# EAGLE design Adafruit_LSM303DLHC (EAGLE 6.3)
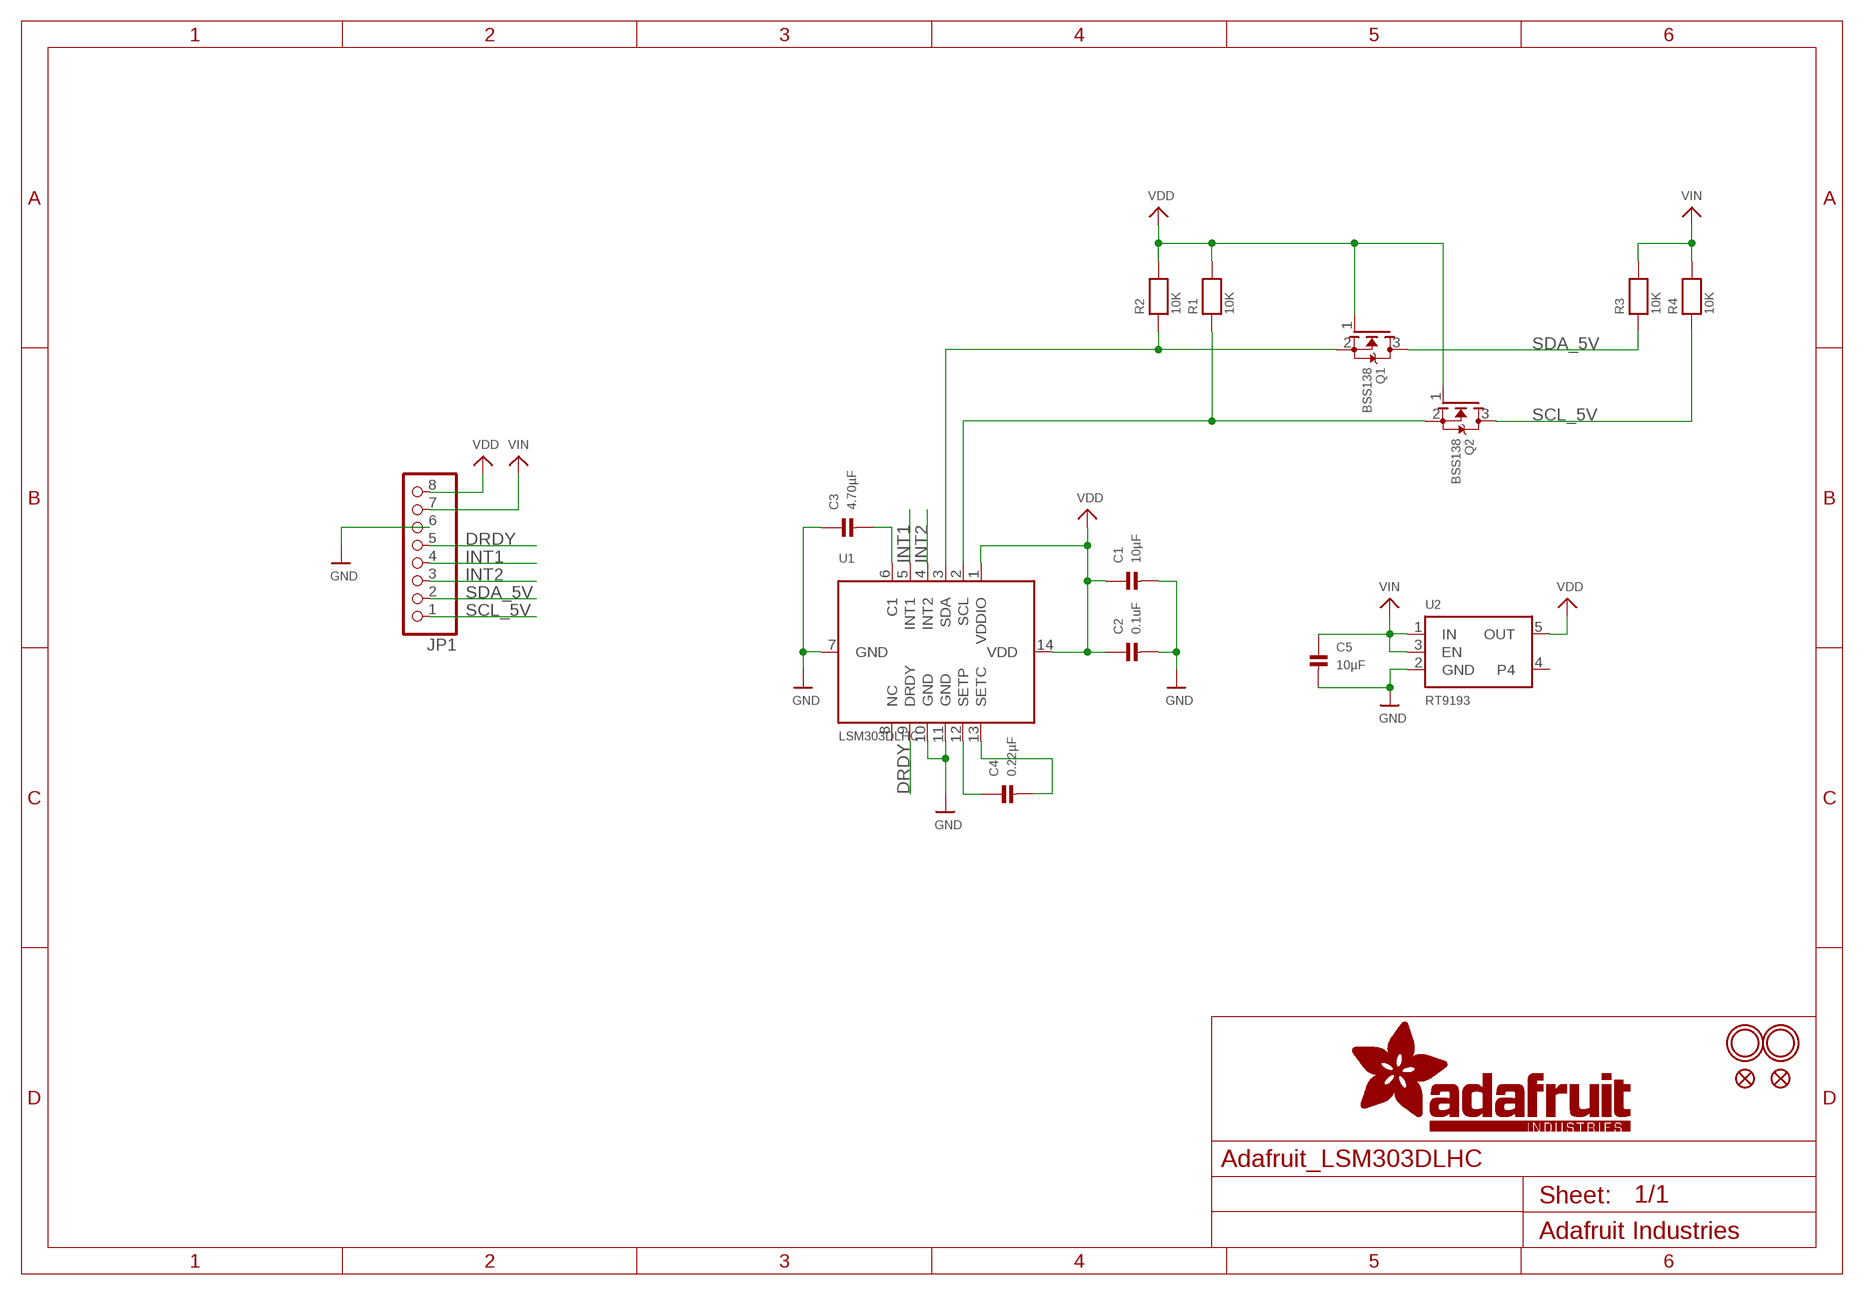
[diagram p0: schematic, sheet 1]

## Parts
C1  10µF  CAP_CERAMIC_0805  [_0805]
C2  0.1uF  CAP_CERAMIC_0805  [_0805]
C3  4.70µF  CAP_CERAMIC_0805  [_0805]
C4  0.22µF  CAP_CERAMIC_0805  [_0805]
C5  10µF  CAP_CERAMIC_0805  [_0805]
FID1  FIDUCIAL""  [FIDUCIAL_1MM]
FID2  FIDUCIAL""  [FIDUCIAL_1MM]
JP1  HEADER-1X876MIL  [1X08_ROUND_76]
Q1  BSS138  MOSFET-NWIDE  [SOT23-WIDE]
Q2  BSS138  MOSFET-NWIDE  [SOT23-WIDE]
R1  10K  RESISTOR_0805  [_0805]
R2  10K  RESISTOR_0805  [_0805]
R3  10K  RESISTOR_0805  [_0805]
R4  10K  RESISTOR_0805  [_0805]
U1  LSM303DLHC  [LGA14]
U2  RT9193  VREG_SOT23-5  [SOT23-5]
U$3  MOUNTINGHOLE2.5  [MOUNTINGHOLE_2.5_PLATED]
U$4  MOUNTINGHOLE2.5  [MOUNTINGHOLE_2.5_PLATED]

## Nets
DRDY: JP1.5 U1.9(DRDY)
GND: C1.2 C2.2 C3.1 C5.2 JP1.6 U1.7(GND) U1.10(GND) U1.11(GND) U2.2(GND)
INT1: JP1.4 U1.5(INT1)
INT2: JP1.3 U1.4(INT2)
N$1: Q1.2(S) R2.1 U1.3(SDA)
N$2: Q2.2(S) R1.1 U1.2(SCL)
N$3: C3.2 U1.6(C1)
N$4: C4.1 U1.12(SETP)
N$5: C4.2 U1.13(SETC)
SCL_5V: JP1.1 Q2.3(D) R4.1
SDA_5V: JP1.2 Q1.3(D) R3.1
VDD: C1.1 C2.1 JP1.8 Q1.1(G) Q2.1(G) R1.2 R2.2 U1.1(VDDIO) U1.14(VDD) U2.5(OUT)
VIN: C5.1 JP1.7 R3.2 R4.2 U2.1(IN) U2.3(EN)
Unconnected: U1.8(NC) U2.4

## Library data of the parts
C1-C5 = microbuilder:CAP_CERAMIC: Ceramic Capacitors 0402 - 0402 Surface Mount Capacitors 16pF 50V 5% [Digikey: 445-4899-2-ND] 18pF 50V 5% [Digikey: 490-1281-2-ND] 22pF 50V 5% [Digikey: 490-1283-2-ND] 68pF 50V 5% [Digikey: 490-1289-2-ND] 0.1uF 10V 10% [Digikey: 490-1318-2-ND] 1.0uF 6.3V 10% [Digikey: 490-1320-2-ND] 0603 - 0603 Surface Mount Capacitors 16 pF 50V 5% [Digikey: 445-5051-2-ND] 22 pF 50V [Digikey: PCC220ACVTR-ND] 33 pF 50V 5% [Digikey: 490-1415-1-ND] 56pF 50V 5% [Digikey: 490-1421-1-ND] 220pF 50V 5% [Digikey: 445-1285-1-ND] 680 pF 50V 2200 pF 50V 5% C0G [Digikey: 445-1297-1-ND] 5600 pF 100V 5% X7R [Digikey: 478-3711-1-ND] 0.1 µF 25V 10% [Digikey: PCC2277TR-ND] 0.22 µF 16V 10% X7R [Digikey: 445-1318-1-ND] 1.0 µF 25V 10% [Digikey: 445-5146-2-ND] 0603 - RF Specific 3pF 250V +/-0.1pF RF [Digikey: 712-1347-1-ND] 18 pF 250V 5% [Digikey: 478-3505-1-ND or 712-1322-1-ND] 56 pF 250V 5% C0G RF [Digikey: 490-4867-1-ND] 68 pF 250V RF [Digikey: 490-4868-1-ND] 0805 - 0805 Surface Mount Capacitors 220 pF 250V 2% RF Ceramic Capacitor [Digikey: 712-1398-1-ND] 1000 pF 50V 2% NP0 Ceramic Capacitor [Digikey: 478-3760-1-ND] 0.1 µF 25V 10% Ceramic Capacitor [Digikey: PCC1828TR-ND] 1.0 µF 16V 10% Ceramic Capacitor[Digikey: 490-1691-2-ND] 10.0 µF 10V 10% Ceramic Capacitor[Digikey: 709-1228-1-ND] 10.0 uF 16V 10% Ceramic Capacitor [Digikey: 478-5165-2-ND] 47 uF 6.3V 20% Ceramic Capacitor [Digikey: 587-1779-1-ND or 399-5506-1-ND] 1206 - 1206 Surface Mount Capacitors 47uF 10V 20% Ceramic Capacitor [Digikey: 490-5528-1-ND or 399-5508-1-ND or 445-6010-1-ND] 100uF 6.3V -20%, +80% Y5V Ceramic Capacitor (Digikey: 490-4512-1-ND, Mouser: 81-GRM31CF50J107ZE1L)
FID1 FID2 = microbuilder:FIDUCIAL: Fiducial Alignment Points Various fiducial points for machine vision alignment.
JP1 = microbuilder:HEADER-1X8: PIN HEADER
Q1 Q2 = microbuilder:MOSFET-N: N-Channel Mosfet LEGEND VDS: Voltage Drain-Source ID: Drain Current RDS(ON): Drain-Source On-State Resistance VGS(TH): Gate-Source Threshold Voltage CISS: Drain-Source Input Capacitance SOT-23 Name VDS ID RDS(ON) VGS(TH) CISS Order Number 2N7002E 60V 260mA 2.5 Ohm 2.5V @ 250uA 26.7pF @ 25V 2N7002ET1GOSTR-ND BSH103 30V 850mA 400 mOhm 400mV @ 1mA 83pF @ 24V BSH103,235-ND BSS138 60V 320mA 1.6 Ohm 1.5V @ 250uA 50pF @ 10V Mouser: 771-BSS138PW115 DMN2075U-7 20V 4.2A 38 mOhm 1V @ 250 uA 594.3pF @ 10V DMN2075U-7DICT-ND * BSS138 good choice for I2C level-shifting
R1-R4 = microbuilder:RESISTOR: Resistors 0402 - 0402 Surface Mount Package 22 Ohm 1% 1/16W [Digikey: 311-22.0LRTR-ND] 33 Ohm 5% 1/16W 1.0K 5% 1/16W 1.5K 5% 1/16W 2.0K 1% 1/16W 10.0K 1% 1/16W [Digikey: 311-10.0KLRTR-ND] 10.0K 5% 1/16W [Digikey: RMCF0402JT10K0TR-ND] 12.1K 1% 1/16W [Digikey: 311-22.0LRTR-ND] 100.0K 5% 1/16W 0603 - 0603 Surface Mount Package 0 Ohm 1/10 Watt 1% Resistor 15 Ohm 1/10 Watt 1% Resistor 33 Ohm 1/10 Watt 1% Resistor 49.9 Ohm 1/10 Watt 1% Resistor 100 Ohm 1/10 Watt 1% Resistor 150 Ohm 1/10 Watt 1% Resistor 240 Ohm 1/10 Watt 1% Resistor 390 Ohm 1/10 Watt 1% Resistor 560 Ohm 1/10 Watt 1% Resistor 680 Ohm 1/10 Watt 1% Resistor 750 Ohm 1/10 Watt 1% Resistor 1.0K Ohm 1/10 Watt 1% Resistor 1.5K Ohm 1/10 Watt 1% Resistor 2.0K Ohm 1/10 Watt 1% Resistor 2.2K Ohm 1/10 Watt 1% Resistor 3.3K Ohm 1/10 Watt 1% Resistor 4.7K Ohm 1/10 Watt 1% Resistor 10.0K Ohm 1/10 Watt 1% Resistor 12.0K Ohm 1/10 Watt 1% Resistor 12.1K Ohm 1/10 Watt 1% Resistor 20.0K Ohm 1/10 Watt 1% Resistor 33.0K Ohm 1/10 Watt 1% Resistor 100.0K Ohm 1/10 Watt 1% Resistor 0805 - 0805 Surface Mount Package 0 Ohm 1/8 Watt 1% Resistor 33 Ohm 1/8 Watt 1% Resistor 100 Ohm 1/8 Watt 1% Resistor 150 Ohm 1/8 Watt 1% Resistor 200 Ohm 1/8 Watt 1% Resistor 240 Ohm 1/8 Watt 1% Resistor 330 Ohm 1/8 Watt 1% Resistor 390 Ohm 1/8 Watt 1% Resistor 470 Ohm 1/8 Watt 1% Resistor 1.0K Ohm 1/8 Watt 1% Resistor 1.5K Ohm 1/8 Watt 1% Resistor 2.0K Ohm 1/8 Watt 1% Resistor 4.7K Ohm 1/8 Watt 1% Resistor 5.1K Ohm 1/8 Watt 1% Resistor 5.6K Ohm 1/8 Watt 1% Resistor 10.0K Ohm 1/8 Watt 1% Resistor 22.0K Ohm 1/8 Watt 1% Resistor 33.0K Ohm 1/8 Watt 1% Resistor 100K Ohm 1/8 Watt 1% Resistor 1206 - 1206 Surface Mount Package 2012 - 2010 Surface Mount Package 0.11 Ohm 1/2 Watt 1% Resistor - Digikey: RHM.11UCT-ND
U1 = microbuilder:LSM303DLHC: LSM303DLHC 3-Axis I2C Accelerometer and 3-Axis Magnetometer VDD: 2.2-3.6V VDDIO: 1.8-VDD Magnetic Range: +/-1.3 to +/-8.1 gauss Accel Range: +/-2/4/8/16 g Temp: -40 - 85°C
U2 = microbuilder:VREG_SOT23-5: SOT23-5 Fixed Voltage Regulators To better organise some of the SOT23-5 fixed voltage regulators in this library, this new part was created. Part Current Out V Out V In V Dropout Digikey Part No. ADP121 150mA 3.3V 3.4-5.5V 0.09V @ 150mA ADP121-AUJZ33R7CT-ND ADP121 150mA 3.0V 3.1-5.5V 0.09V @ 150mA ADP121-AUJZ30R7CT-ND ADP122 300mA 3.3V 3.4-5.5V 0.085V @ 300mA ADP122AUJZ-3.3-R7CT-ND ADP1712 300mA 3.3V 3.5-5.5V 0.17V @ 300mA ADP1712AUJZ-3.3-R7TR-ND AP7311 (Low Cost) 150mA 3.3V 3.5-6V 0.15V @ 150mA AP7311-33WG-7DICT-ND LD39015M18R 150mA 1.8V 1.9V-5.5V 0.08V @ 100mA 497-6977-1-ND MCP1824T-3302E/OT 300mA 3.3V 3.5V-6V 0.2V @ 300mA MCP1824T-3302E/OTCT-ND MIC5205-2.5YM5 TR 150mA 2.5V 2.7-16V 0.165V @ 150mA 576-1257-2-ND MIC5205-3.0YM5 TR 150mA 3.0V 3.2V-16V 0.165V @ 150mA 576-1258-2-ND MIC5205-3.3YM5 TR 150mA 3.3V 3.5V-16V 0.165V @ 150mA 576-1259-2-ND TPS780330220 150mA 3.3V+2.2V 3.6-5.5V 250mV Max 296-23332-1-ND TDA3663/N1,135 100mA 3.3V 3.5-45V 0.18V @ 50mA 568-5343-1-ND
U$3 U$4 = microbuilder:MOUNTINGHOLE: Mounting Hole For #2 screws (0.086"/2.18mm width, 0.094"/2.4mm hole) use 2.5mm

## Board
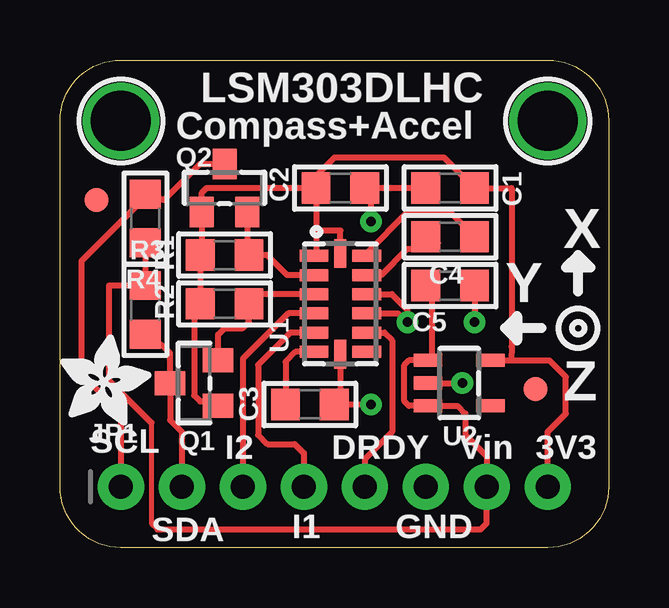
[diagram p1: board, top side]
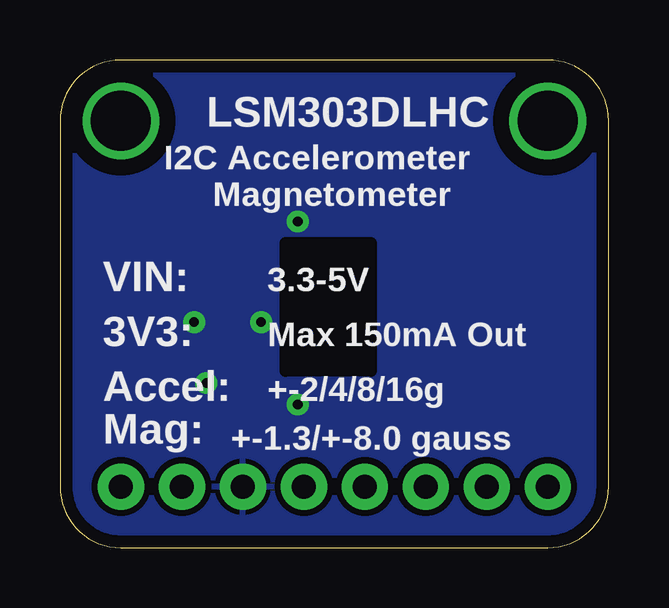
[diagram p2: board, bottom side, seen from below]

Size 22.86 x 20.32 mm. Coordinates in mm from the lower left corner, seen from the top.
Outline: 0,2.54 0,17.78 arc-90 2.54,20.32 20.32,20.32 arc-90 22.86,17.78 22.86,2.54 arc-90 20.32,0 2.54,0 arc-90 0,2.54
Copper layers (1*16): Top 0.035mm / dielectric 1.5mm / Bottom 0.035mm
Design rules "default": minimum track width 8mil, minimum drill 0.4mm, track to track 8mil, track to pad 8mil, pad to pad 8mil, via to via 8mil, smd to smd 8mil, copper to edge 20mil, drill to drill 8mil, minimum pad ring 8mil, minimum via ring 10mil, stop-mask expansion 3mil, vias tented up to drill 20mil, thermal gap 8mil
bRestrict: area 9.9,7.4 to 13.5,12.7

### Footprints (pad centres in the part's own frame; a part is rotated, then mirrored left to right if it is on the bottom)
_0805 = smd 1.2 x 1.3: 1 -1.016,0; 2 1.016,0
FIDUCIAL_1MM = smd 1 x 1: 1 0,0
1X08_ROUND_76 = drill 1 pad 1.93: 1 -8.89,0; 2 -6.35,0; 3 -3.81,0; 4 -1.27,0; 5 1.27,0; 6 3.81,0; 7 6.35,0; 8 8.89,0
SOT23-WIDE = smd 1 x 1.27: 1 -0.95,-1; 2 0.95,-1; 3 0,1
LGA14 = smd 0.5 x 1.2: 1 2,1.1; 2 1.2,1.1; 3 0.4,1.1; 4 -0.4,1.1; 5 -1.2,1.1; 6 -2,1.1; 8 -2,-1.1; 9 -1.2,-1.1; 10 -0.4,-1.1; 11 0.4,-1.1; 12 1.2,-1.1; 13 2,-1.1 | smd 1.2 x 0.5: 7 -2.1,0; 14 2.1,0
SOT23-5 = smd 0.55 x 1.2: 1 -0.95,-1.3; 2 0,-1.3; 3 0.95,-1.3; 4 0.95,1.3; 5 -0.95,1.3
MOUNTINGHOLE_2.5_PLATED = drill 2.5 pad 3.2: P$1 0,0

### Placement (x,y rotation side)
C1  16.26,14.99 180 top
C2  11.68,14.99 0 top
C3  10.41,5.97 180 top
C4  16.26,12.95 0 top
C5  16.26,10.92 0 top
FID1  1.52,14.48 0 top
FID2  19.81,6.6 0 top
JP1  11.43,2.54 0 top
Q1  5.59,6.86 90 top
Q2  6.86,14.99 0 top
R1  6.86,12.19 180 top
R2  6.86,10.16 180 top
R3  3.56,9.91 90 top
R4  3.56,13.72 270 top
U1  11.68,10.16 90 top
U2  16.64,6.86 270 top
U$3  2.54,17.78 0 top
U$4  20.32,17.78 0 top
U$17  [ADAFRUIT_3.5MM]  0,5.08 0 top

### Tracks (layer width: path | path; a pad name or v marks a point on that pad's centre or on a via)
DRDY
  Top 0.254: U1.9 13.52,8.96 13.84,8.64 13.84,4.83 12.7,3.68 JP1.5
GND  (via drill 0.4)
  Top 0.254: U2.2 v16.76,6.86 | C5.2 v17.27,9.4 | v12.95,5.97 C3.1 11.68,5.84 U1.7 | U1.11 13.82,10.56 14.48,9.91 v14.48,9.4 14.08,9.76 U1.10 | v12.95,13.59 12.95,14.99 C2.2 C1.2
  Bottom 0.254: v14.48,9.4 14.73,9.4
  pour Bottom (isolate 0.254): 0,20.32 22.86,20.32 22.86,0 0,0
INT1
  Top 0.254: U1.5 9.6,8.96 8.26,7.62 8.26,4.7 8.64,4.32 9.78,4.32 10.16,3.94 JP1.4
INT2
  Top 0.254: U1.4 9.51,9.76 7.62,7.87 JP1.3
N$1
  Top 0.254: U1.3 8.24,10.56 R2.1 7.87,9.4 7.62,9.14 6.86,9.14 6.59,8.87 Q1.2
N$2
  Top 0.254: Q2.2 7.81,12.26 R1.1 8.64,12.19 9.47,11.36 U1.2
N$3
  Top 0.254: U1.6 9.81,8.16 9.4,7.75 C3.2
N$4
  Top 0.254: U1.12 13.39,11.36 14.48,12.45 15.49,12.45 15.75,12.7 C4.1
N$5
  Top 0.254: U1.13 12.78,12.28 14.48,13.97 16.26,13.97 C4.2
SCL_5V
  Top 0.254: Q2.3 5.83,15.99 4.32,14.48 R4.1 3.56,14.61 0.89,11.94 0.89,7.24 2.54,5.59 JP1.1
SDA_5V
  Top 0.254: R3.1 4.32,8.38 4.59,8.11 Q1.3 4.59,5.32 5.08,4.83 JP1.2
VDD
  Top 0.254: C2.1 10.67,13.21 | 10.67,13.21 10.67,12.24 U1.1 | U1.14 11.68,13.21 10.67,13.21 | Q1.1 6.52,6.1 5.84,6.1 5.59,6.35 5.59,9.91 5.84,9.91 R2.2 R1.2 5.91,12.26 Q2.1 5.91,14.8 6.1,14.99 C2.1 | JP1.8 20.32,4.83 21.08,5.59 21.08,7.11 20.39,7.81 18.8,7.81 | U2.5 18.8,7.81 | 18.8,7.81 18.82,8.38 18.82,14.99 C1.1 16,16.26 11.43,16.26 10.67,15.49 C2.1
VIN
  Top 0.203: 3.81,5.21 3.81,1.02 4.06,0.76
  Top 0.254: R4.2 R3.2 2.03,10.92 2.03,6.99 3.81,5.21 | 4.06,0.76 17.53,0.76 17.78,1.02 JP1.7 17.78,3.81 16.89,4.7 16.89,5.59 16.57,5.91 U2.3 14.54,5.91 14.35,6.1 14.35,7.62 14.54,7.81 U2.1 15.49,7.96 15.49,10.67 C5.1

### Text on the board
tPlace: LSM303DLHC | Compass+Accel | X | Y | Z | SCL | I2 | DRDY | Vin | 3V3 | SDA | I1 | GND
bPlace: LSM303DLHC | I2C Accelerometer | Magnetometer | 3.3-5V | VIN: | Max 150mA Out | 3V3: | +-2/4/8/16g | Accel: | +-1.3/+-8.0 gauss | Mag: